# EasyEDA Pro project STM32科协学习板.eprj, schematic Schematic1
Board Name: Board1; Create Date: 2025-05-22; Page Name: P1; Project Name: STM32科协学习板; Schematic Name: Schematic1; Update Date: 2025-05-22; Company: 嘉立创EDA; Page Size: A4; Version: V1.0
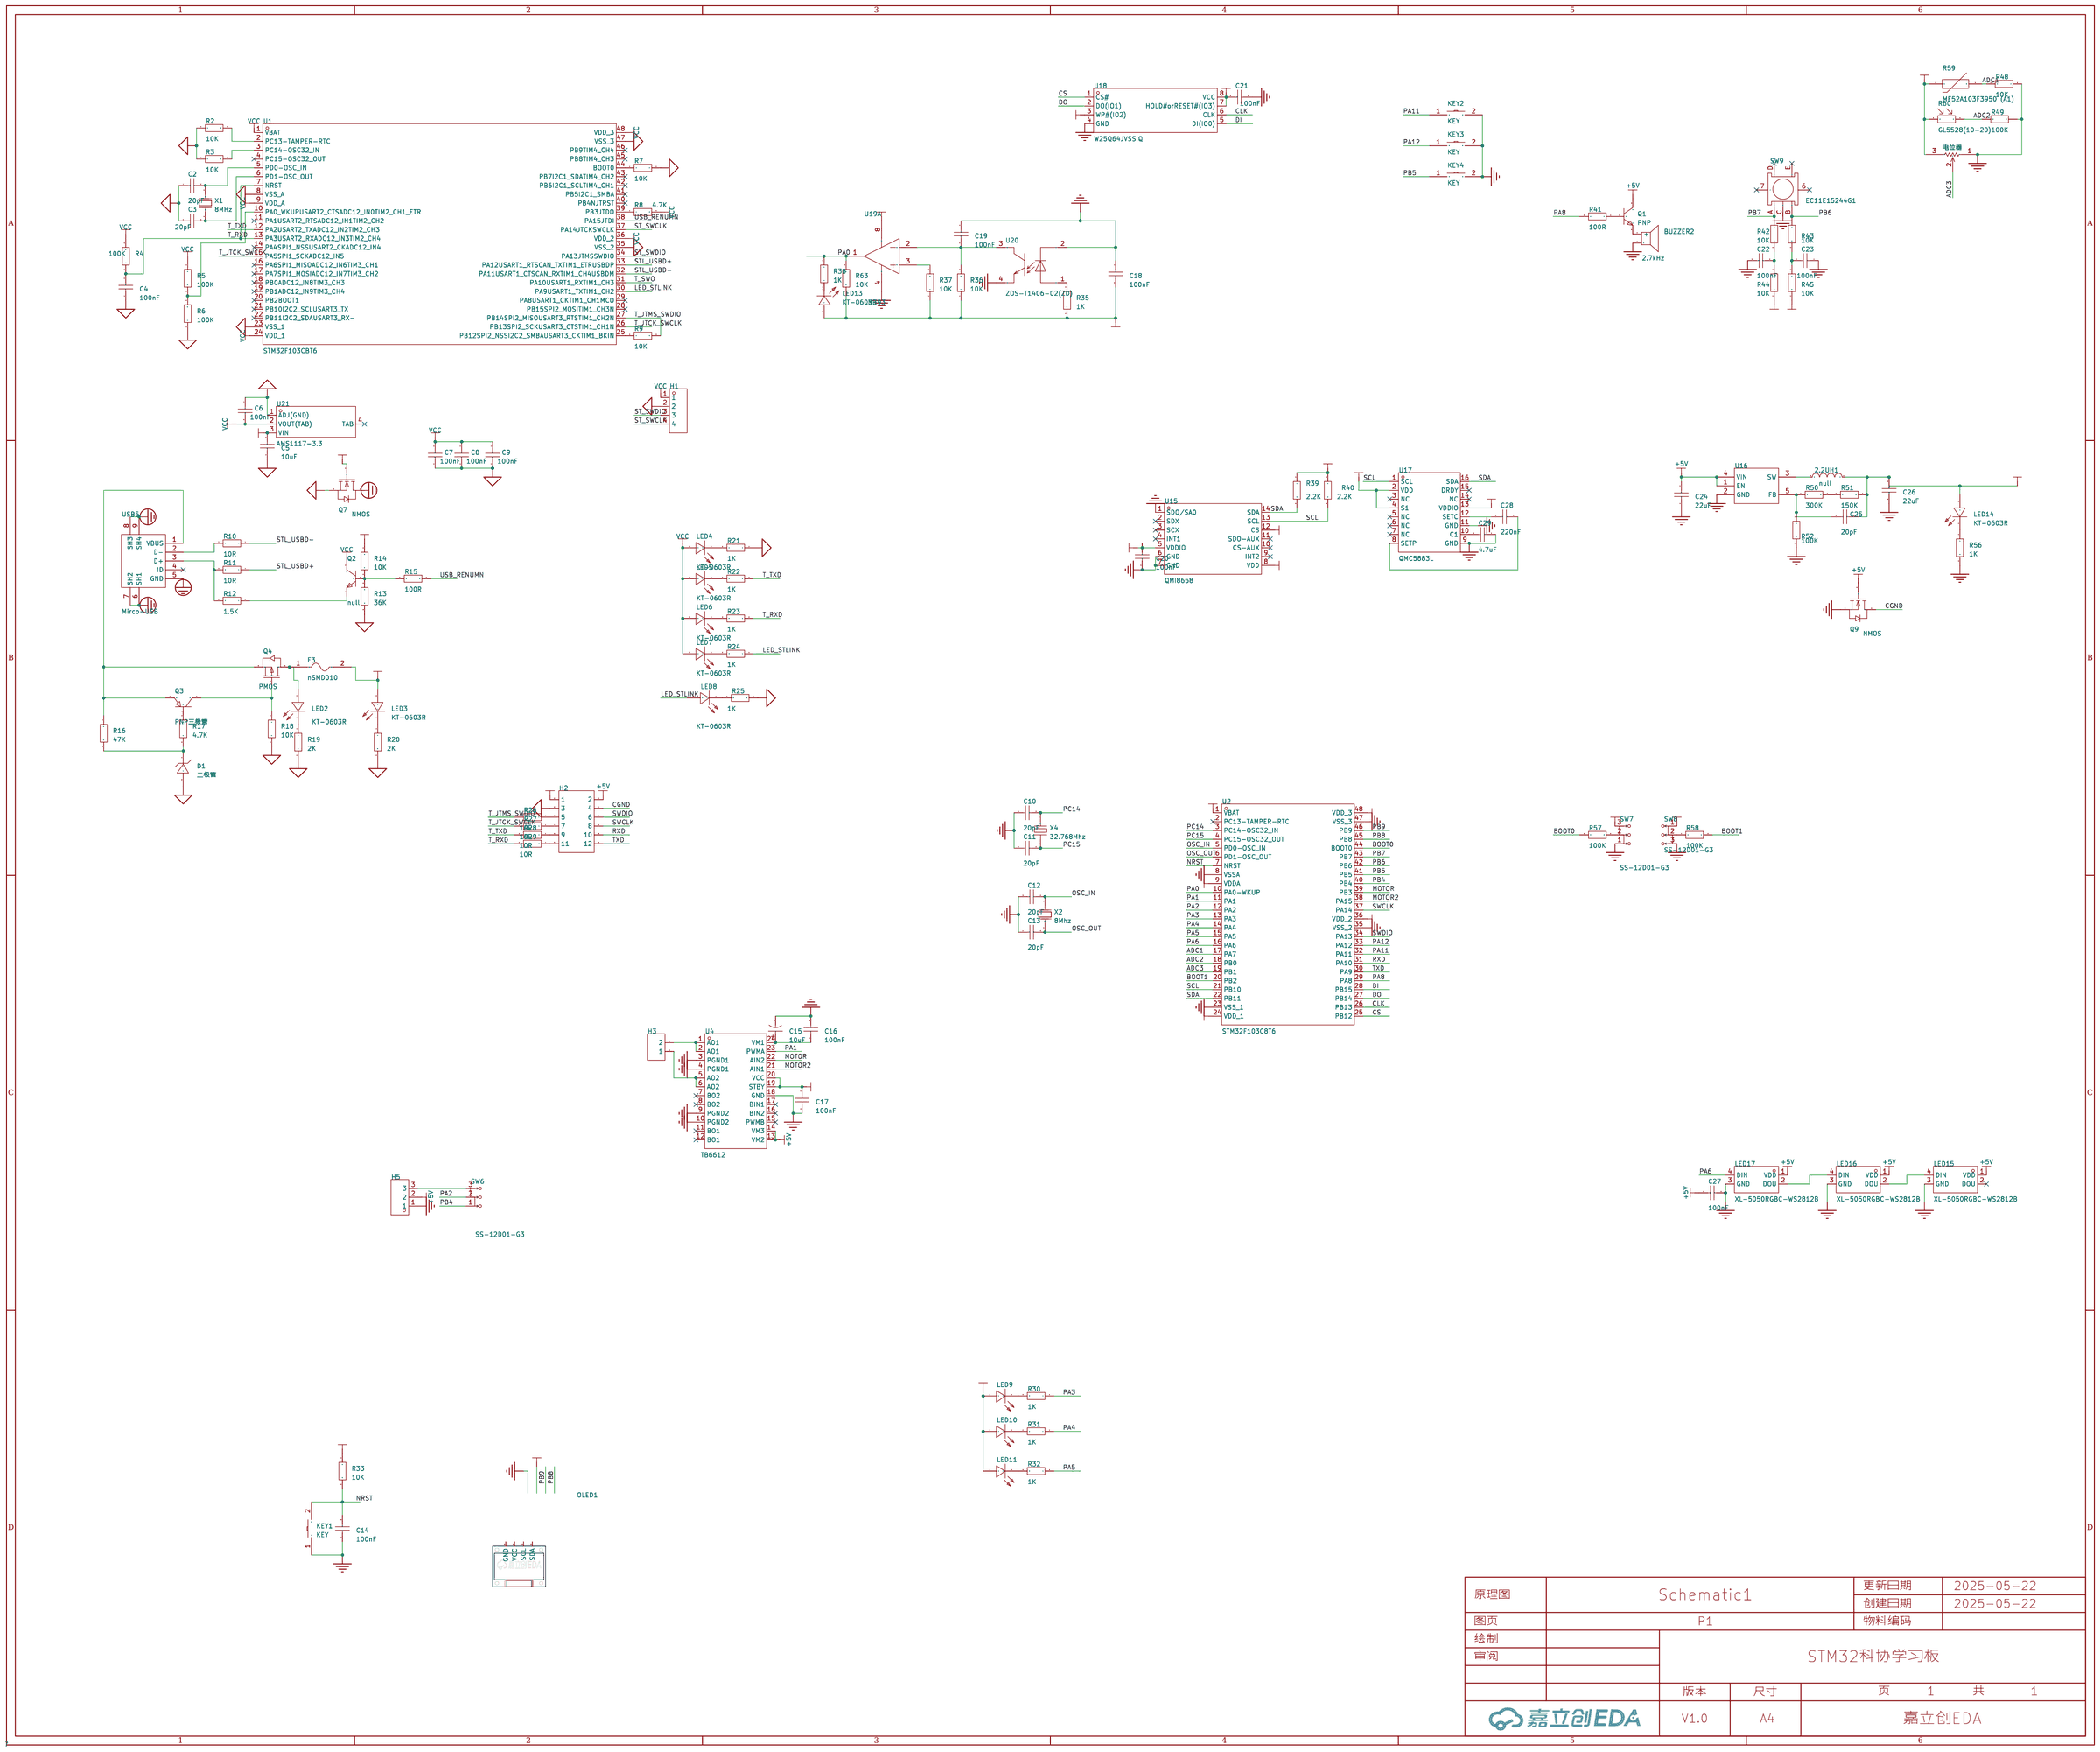
[diagram p0: schematic sheet]

## Parts
2.2UH1  2.2UH  [IND-SMD_L4.0-W4.0_FNR40XXS]
BUZZER2  2.7kHz  [BUZ-TH_BD12.0-P7.60-D0.6-FD]
C2  20pF  [C0603]
C3  20pF  [C0603]
C4  100nF  [C0603]
C5  10uF  [C0603]
C6  100nF  [C0603]
C7  100nF  [C0603]
C8  100nF  [C0603]
C9  100nF  [C0603]
C10  20pF  [C0603]
C11  20pF  [C0603]
C12  20pF  [C0603]
C13  20pF  [C0603]
C14  100nF  [C0603]
C15  10uF  [CASE-A_3216]
C16  100nF  [C0603]
C17  100nF  [C0603]
C18  100nF  [C0603]
C19  100nF  [C0603]
C20  100nF  [C0603]
C21  100nF  [C0603]
C22  100nF  [C0603]
C23  100nF  [C0603]
C24  22uF  [C0603]
C25  20pF  [C0603]
C26  22uF  [C0603]
C27  100nF  [C0603]
C28  220nF  [C0603]
C29  4.7uF  [C0603]
D1  二极管  [SOD-123_L2.7-W1.6-LS3.7-RD]
F3  nSMD010  [F1206]
H1  -  [HDR-TH_4P-P2.54-V-F]
H2  -  [HDR-TH_12P-P2.54-V-M-R2-C6-S2.54]
H3  -  [HDR-TH_2P-P2.54-V-F]
H5  -  [HDR-TH_3P-P2.54-V-F]
KEY1  KEY  [SW-SMD_L6.0-W3.3-LS8.0]
KEY2  KEY  [SW-SMD_L6.0-W3.3-LS8.0]
KEY3  KEY  [SW-SMD_L6.0-W3.3-LS8.0]
KEY4  KEY  [SW-SMD_L6.0-W3.3-LS8.0]
LED2  KT-0603R  [LED0603-RD]
LED3  KT-0603R  [LED0603-RD]
LED4  KT-0603R  [LED0603-RD]
LED5  KT-0603R  [LED0603-RD]
LED6  KT-0603R  [LED0603-RD]
LED7  KT-0603R  [LED0603-RD]
LED8  KT-0603R  [LED0603-RD]
LED9  KT-0603R  [LED0603-RD]
LED10  KT-0603R  [LED0603-RD]
LED11  KT-0603R  [LED0603-RD]
LED13  KT-0603R  [LED0603-RD]
LED14  KT-0603R  [LED0603-RD]
LED15  XL-5050RGBC-WS2812B  [LED-SMD_4P-L5.0-W5.0-BL_XL-5050RGBC]
LED16  XL-5050RGBC-WS2812B  [LED-SMD_4P-L5.0-W5.0-BL_XL-5050RGBC]
LED17  XL-5050RGBC-WS2812B  [LED-SMD_4P-L5.0-W5.0-BL_XL-5050RGBC]
OLED1  -  [0.96OLED_4P]
Q1  PNP  [SOT-23-3_L2.9-W1.3-P1.90-LS2.4-BR]
Q2  null  [SOT-23-3_L2.9-W1.3-P1.90-LS2.4-BR]
Q3  PNP三极管  [SOT-23-3_L2.9-W1.3-P1.90-LS2.4-BR]
Q4  PMOS  [SOT-23_L2.9-W1.3-P1.90-LS2.4-BR]
Q7  NMOS  [SOT-23-3_L2.9-W1.3-P1.90-LS2.4-BR]
Q9  NMOS  [SOT-23-3_L2.9-W1.3-P1.90-LS2.4-BR]
R2  10K  [R0603]
R3  10K  [R0603]
R4  100K  [R0603]
R5  100K  [R0603]
R6  100K  [R0603]
R7  10K  [R0603]
R8  4.7K  [R0603]
R9  10K  [R0603]
R10  10R  [R0603]
R11  10R  [R0603]
R12  1.5K  [R0603]
R13  36K  [R0603]
R14  10K  [R0603]
R15  100R  [R0603]
R16  47K  [R0603]
R17  4.7K  [R0603]
R18  10K  [R0603]
R19  2K  [R0603]
R20  2K  [R0603]
R21  1K  [R0603]
R22  1K  [R0603]
R23  1K  [R0603]
R24  1K  [R0603]
R25  1K  [R0603]
R26  10R  [R0603]
R27  10R  [R0603]
R28  10R  [R0603]
R29  10R  [R0603]
R30  1K  [R0603]
R31  1K  [R0603]
R32  1K  [R0603]
R33  10K  [R0603]
R35  1K  [R0603]
R36  10K  [R0603]
R37  10K  [R0603]
R38  1K  [R0603]
R39  2.2K  [R0603]
R40  2.2K  [R0603]
R41  100R  [R0603]
R42  10K  [R0603]
R43  10K  [R0603]
R44  10K  [R0603]
R45  10K  [R0603]
R48  10K  [R0603]
R49  100K  [R0603]
R50  300K  [R0603]
R51  150K  [R0603]
R52  100K  [R0603]
R56  1K  [R0603]
R57  100K  [R0603]
R58  100K  [R0603]
R59  MF52A103F3950 (A1)  [RES-TH_L2.5-W2.5-P1.70-D0.3]
R60  GL5528(10-20)  [RES-TH_L5.1-W4.3-P3.40-D0.5]
R63  10K  [R0603]
SW6  SS-12D01-G3  [SW-TH_SS-12D01-GX]
SW7  SS-12D01-G3  [SW-TH_SS-12D01-GX]
SW8  SS-12D01-G3  [SW-TH_SS-12D01-GX]
SW9  EC11E15244G1  [SW-TH_EC11E15244G1]
U1  STM32F103CBT6  [LQFP-48_L7.0-W7.0-P0.50-LS9.0-BL]
U2  STM32F103C8T6  [LQFP-48_L7.0-W7.0-P0.50-LS9.0-BL]
U4  TB6612  [SSOP-24_L8.4-W5.8-P0.65-LS7.8-BL]
U15  QMI8658  [LGA-14_L3.0-W2.5-P0.50-TL]
U16  -  [SOT-23-5_L3.0-W1.7-P0.95-LS2.8-BR]
U17  QMC5883L  [LGA-16_L3.0-W3.0-P0.50-BL_SQ]
U18  W25Q64JVSSIQ  [SOIC-8_L5.3-W5.3-P1.27-LS8.0-BL]
U19  LM393  [SOP-8_L4.9-W3.9-P1.27-LS6.0-BL]  (section 1)
U20  ZOS-T1406-02(ZD)  [OPTO-TH_ZOS-T1406-02]
U21  AMS1117-3.3  [SOT-223-4_L6.5-W3.5-P2.30-LS7.0-BR]
USB5  Mirco-USB  [MICRO-USB-SMD_MICROXNJ]
X1  8MHz  [OSC-TH_L10.0-W4.5-P5.00]
X2  8MHz  [OSC-TH_L10.0-W4.5-P5.00]
X4  32.768kHz  [OSC-SMD_L3.2-W1.5]
电位器  -  [单联拨盘电位器]

## Library data of the parts
2.2UH1 = FNR4030S4R7MT: 电感值:4.7uH;精度:±20%;额定电流:2.3A;饱和电流(Isat):3.2A;; LCSC Part Name: 4.7uH ±20% 3.2A; Supplier Part: C167874; Manufacturer: cjiang(长江微电); Supplier Footprint: SMD,4x4mm; JLCPCB Part Class: 扩展库; Datasheet: https://atta.szlcsc.com/upload/public/pdf/source/20190327/C167925_9EFF0AABC4CA629C2CC95961DBF7D39D.pdf; Supplier: LCSC; Tolerance: ±20%; Rated Current: 2.3A; Saturation Current (Isat): 3.2A; DC Resistance (DCR): 78mΩ
BUZZER2 = SUN-12095-5VPA7.6: 驱动方式:有源(内含驱动线路);构造类型:电磁式;频率:2.7kHz;声压(SPL):85dB@5V,10cm;; LCSC Part Name: 电磁有源蜂鸣器; Supplier Part: C360615; Manufacturer: S&S(海旭); Supplier Footprint: 插件,D=12mm; JLCPCB Part Class: 扩展库; Datasheet: https://atta.szlcsc.com/upload/public/pdf/source/20210819/7581CEB8074681E6630BEBBFB8B64446.pdf; Supplier: LCSC; Oscillator Circuit: 有源(内含驱动线路); Technology Type: 电磁式; Operating Voltage: 3V~7V; Sound Pressure Level (SPL): 85dB@5V,10cm; Diameter (φD): 12mm; Height: 9.8mm
C2-C14 C16-C29 = CL10C220JB8NNNC: 容值:22pF;精度:±5%;额定电压:50V;材质(温度系数):C0G;; LCSC Part Name: 22pF ±5% 50V; Supplier Part: C1653; Manufacturer: SAMSUNG(三星); Supplier Footprint: 0603; JLCPCB Part Class: 基础库; Datasheet: https://atta.szlcsc.com/upload/public/pdf/source/20160218/1457707763339.pdf; Supplier: LCSC; Tolerance: ±5%; Voltage Rated: 50V; Temperature Coefficient: C0G
C15 = CA45-A016K106T: 容值:10uF;精度:±10%;额定电压:16V;等效串联电阻:3Ω@100kHz;; LCSC Part Name: 10uF ±10% 16V; Supplier Part: C119051; Manufacturer: 湘怡中元/湘江; Supplier Footprint: CASE-A-3216; JLCPCB Part Class: 扩展库; Datasheet: https://atta.szlcsc.com/upload/public/pdf/source/20191009/C435293_78A410F3D73489DBEAC46056C4262F7A.pdf; Supplier: LCSC; Tolerance: ±10%; Rated Voltage: 16V; Equivalent Series Resistance(ESR): 3Ω@100kHz; Operating Temperature: -55℃~+125℃
D1 = BZT52C12_C173429: 二极管配置:独立式;稳压值(标称值):12V;稳压值(范围):11.4V~12.7V;功率:500mW;精度:-;; LCSC Part Name: BZT52C12; Supplier Part: C173429; Manufacturer: MDD; Manufacturer Part: BZT52C12; Supplier Footprint: SOD-123; JLCPCB Part Class: 扩展库; Datasheet: https://atta.szlcsc.com/upload/public/pdf/source/20230823/A46C7C97908205398E4407DE202CED03.pdf; Supplier: LCSC; Diode Configuration: 独立式; Zener Voltage (Nom): 12V; Reverse Leakage Current (Ir): 100nA@8V; Zener Voltage (Range): 11.4V~12.7V; Power Dissipation: 500mW; Zener Impedance (Zzt): 25Ω
F3 = nSMD010: 最大电压:60V;最大电流:40A;保持电流:100mA;跳闸电流:250mA;; LCSC Part Name: 0.10A 60V 自恢复保险丝; Supplier Part: C70065; Manufacturer: 台湾陆海; Supplier Footprint: 1206; JLCPCB Part Class: 扩展库; Datasheet: https://atta.szlcsc.com/upload/public/pdf/source/20230404/ADB19886462D98F83AD677B1F8114E76.pdf; Supplier: LCSC; Operating Voltage (Max): 60V; Current Rating (Max): 40A; Hold Current: 100mA; Trip Current: 250mA; Power Dissipation: -；-；-；-; Operating Temperature: -40℃~+85℃
H1 = HDR-F_2.54_1x4P: Supplier Part: C2718488; Supplier Footprint: 插件
H2 = HDR-F_2.54_2x6: Supplier Part: C92270; Supplier Footprint: 插件
H3 = HDR-F_2.54_1x2P: Supplier Part: C49661; Supplier Footprint: 插件
H5 = HDR-F_2.54_1x3P: Supplier Part: C541850; Supplier Footprint: 插件
KEY1-KEY4 = TS-1101-C-W: 电路结构:单刀单掷;按钮形状:矩形按钮;作用力:260gf;安装方式:立贴;开关长度:6mm;开关宽度:3.6mm;开关高度:2.5mm;带支架:不带;触点电流:50mA;额定电压(AC):-;额定电压(DC):12V;额定功率:-;绝缘电阻:-;带灯:无;机械寿命:5万次;; LCSC Part Name: 6*3.6*2.5mm 立贴 轻触开关; Supplier Part: C318938; Manufacturer: XKB Connectivity(中国星坤); Supplier Footprint: SMD; JLCPCB Part Class: 扩展库; Datasheet: https://atta.szlcsc.com/upload/public/pdf/source/20200227/C318938_C2E53B1EEDE37D980A33616AC086DE53.pdf; Supplier: LCSC; Circuit: 单刀单掷; Actuator Style: 矩形按钮; Operating Force: 260gf; Mounting Style: 立贴; Switch Length: 6mm; Switch Width: 3.6mm; Switch Height: 2.5mm; Strike Gundam: 不带; Contact Current: 50mA; Voltage Rating (DC): 12V; Actuator/Cap Color: 白色带淡绿; With Lamp: 无; Mechanical Life: 5万次; Operating Temperature: -30℃~+85℃
LED2-LED11 LED13 LED14 = KT-0603R: 发光颜色:红色;功率:-;正向电流:-;主波长:-;二极管配置:-;透镜颜色:-;色温:-;发光角度:-;载带方式:-;工作温度:-40℃~+85℃;; LCSC Part Name: 0603 红灯 高亮; Supplier Part: C2286; Manufacturer: KENTO; Supplier Footprint: 0603; JLCPCB Part Class: 基础库; Datasheet: https://atta.szlcsc.com/upload/public/pdf/source/20160616/1466072038404.pdf; Supplier: LCSC; Emitted Color: 红色; Operating Temperature: -40℃~+85℃
LED15-LED17 = XL-5050RGBC-WS2812B: 5050七彩幻彩透明贴片LED灯珠 5050 幻彩透明四脚 ws2812B 内置驱动IC; Supplier Part: C2843785; Manufacturer: XINGLIGHT(成兴光); Supplier Footprint: SMD5050; JLCPCB Part Class: 扩展库; Datasheet: https://atta.szlcsc.com/upload/public/pdf/source/20240412/E1004CAA80592E31D08BFE019083806F.pdf; Supplier: LCSC
OLED1 = 0.96OLED模块_4P: Supplier Footprint: 插件
Q1 Q2 = M8050_C266599: 晶体管类型:NPN;集电极电流(Ic):800mA;集射极击穿电压(Vceo):25V;功率(Pd):200mW;; LCSC Part Name: 耐压:25V 电流:800mA NPN; Supplier Part: C266599; Manufacturer: BORN(伯恩半导体); Manufacturer Part: M8050; Supplier Footprint: SOT-23; JLCPCB Part Class: 扩展库; Datasheet: https://atta.szlcsc.com/upload/public/pdf/source/20190325/C266599_C3D99E625B293D75672D2862955AF640.pdf; Supplier: LCSC; Transistor Type: NPN; Collector Current (Ic): 800mA; Collector-Emitter Breakdown Voltage (Vceo): 25V; Power Dissipation (Pd): 200mW
Q3 = PMBT3906,215: 晶体管类型:PNP;集电极电流(Ic):200mA;集射极击穿电压(Vceo):40V;功率(Pd):250mW;直流电流增益(hFE@Ic,Vce):100@10mA,1V;; LCSC Part Name: PNP 电流:200mA 耐压:40V; Supplier Part: C8670; Manufacturer: Nexperia(安世); Supplier Footprint: SOT-23; JLCPCB Part Class: 扩展库; Datasheet: https://atta.szlcsc.com/upload/public/pdf/source/20130412/1457706600965.pdf; Supplier: LCSC; Transistor Type: PNP; Collector Current (Ic): 200mA; Collector-Emitter Breakdown Voltage (Vceo): 40V; Power Dissipation (Pd): 250mW; DC Current Gain (hFE@Ic,Vce): 100@10mA,1V; Transition Frequency (fT): 250MHz; Collector Cut-Off Current (Icbo): 50nA; Collector-Emitter Saturation Voltage (VCE(sat)@Ic,Ib): 400mV@50mA,5mA
Q4 = AO3401A_C347476: 类型:1个P沟道;漏源电压(Vdss):30V;连续漏极电流(Id):4.2A;功率(Pd):1.4W;导通电阻(RDS(on)@Vgs,Id):50mΩ@4.2A,10V;阈值电压(Vgs(th)@Id):1.3V@250uA;; LCSC Part Name: 1个P沟道 耐压:30V 电流:4.2A; Supplier Part: C347476; Manufacturer: UMW(友台半导体); Manufacturer Part: AO3401A; Supplier Footprint: SOT-23; JLCPCB Part Class: 扩展库; Datasheet: https://atta.szlcsc.com/upload/public/pdf/source/20231109/42F312EBB081D72F04A7E8221BFFAF9D.pdf; Supplier: LCSC; Type: 1个P沟道; Drain Source Voltage (Vdss): 30V; Continuous Drain Current (Id): 4.2A; Power Dissipation (Pd): 1.4W; Drain Source On Resistance (RDS(on)@Vgs,Id): 50mΩ@4.2A,10V; Gate Threshold Voltage (Vgs(th)@Id): 1.3V@250uA; Total Gate Charge (Qg@Vgs): 9.4nC@4.5V; Input Capacitance (Ciss@Vds): 954pF@15V
Q7 Q9 = 2N7002_C8545: 类型:1个N沟道;漏源电压(Vdss):60V;连续漏极电流(Id):115mA;导通电阻(RDS(on)@Vgs,Id):5Ω@10V;功率(Pd):225mW;阈值电压(Vgs(th)@Id):2.5V@250uA;; LCSC Part Name: 1个N沟道 耐压:60V 电流:115mA; Supplier Part: C8545; Manufacturer: CJ(江苏长电/长晶); Supplier Footprint: SOT-23; JLCPCB Part Class: 基础库; Datasheet: https://atta.szlcsc.com/upload/public/pdf/source/20171228/C164913_15144413269051213916.pdf; Supplier: LCSC; Type: 1个N沟道; Drain Source Voltage (Vdss): 60V; Continuous Drain Current (Id): 115mA; Drain Source On Resistance (RDS(on)@Vgs,Id): 5Ω@10V; Power Dissipation (Pd): 225mW; Gate Threshold Voltage (Vgs(th)@Id): 2.5V@250uA; Input Capacitance (Ciss@Vds): 50pF; Reverse Transfer Capacitance (Crss@Vds): 5pF; Operating Temperature: -55℃~+150℃
R2-R33 R35-R45 R48-R52 R56-R58 R63 = 0603WAF200JT5E: 电阻类型:厚膜电阻;阻值:20Ω;精度:±1%;功率:100mW;最大工作电压:75V;温度系数:±100ppm/℃;; LCSC Part Name: 20Ω ±1% 100mW 厚膜电阻; Supplier Part: C22950; Manufacturer: UNI-ROYAL(厚声); Supplier Footprint: 0603; JLCPCB Part Class: 基础库; Datasheet: https://atta.szlcsc.com/upload/public/pdf/source/20200306/C422600_1E6D84923E4A46A82E41ADD87F860B5C.pdf; Supplier: LCSC; Type: 厚膜电阻; Tolerance: ±1%; Power(Watts): 100mW; Overload Voltage (Max): 75V; Temperature Coefficient: ±100ppm/℃; Operating Temperature Range: -55℃~+155℃
R59 = MF52A103F3950 (A1): 阻值(25℃):10kΩ;B值(25℃/50℃):3950K;电阻精度:±1%;功率:50mW;B值精度:±1%;最大稳态电流(25℃):-;; LCSC Part Name: 10kΩ 电阻精度:±1% 3950K; Supplier Part: C13879; Manufacturer: 时恒; Supplier Footprint: 插件,P=1.7mm; JLCPCB Part Class: 扩展库; Datasheet: https://atta.szlcsc.com/upload/public/pdf/source/20181018/C324070_6015F64EA824A635FDB9BBFA1E1FD5FE.pdf; Supplier: LCSC; Resistance @ 25℃: 10kΩ; B Constant (25℃/50℃): 3950K; Resistance Tolerance: ±1%; Power: 50mW; B Constant Tolerance: ±1%; Operating Temperature: -55℃~+125℃
R60 = GL5528(10-20)_C10081: 暗电阻:1MΩ;亮电阻 @ 10Lux:10kΩ~20kΩ;光谱峰值(波长):540nm;; LCSC Part Name: 亮电阻:10kΩ~20kΩ 暗电阻:1MΩ; Supplier Part: C10081; Manufacturer: JCHL(晶创和立); Supplier Footprint: 插件,P=3.4mm; JLCPCB Part Class: 扩展库; Datasheet: https://atta.szlcsc.com/upload/public/pdf/source/20200417/C515010_C10502EF7F431E893A7F20DB83F527F0.pdf; Supplier: LCSC; Dark Resistance: 1MΩ; Illuminated Resistance @ 10Lux: 10kΩ~20kΩ; Applied Voltage: 150V; Spectral Peak: 540nm
SW6-SW8 = SS-12D01-G3: 柄长3MM,1P2T,額定電源:0.3A ,50VDC,迴路:1P2T,操作力:250gf接觸阻抗:200mΩ,使用次數:10,000次,焊接方式:DIP TYPE,包裝方式:1,000PCS/Bag; LCSC Part Name: 8.8*3.9*4.0mm/柄长3MM,1P2T; Supplier Part: C698216; Manufacturer: USAKRO(美韩); Supplier Footprint: 插件; JLCPCB Part Class: 扩展库; Datasheet: https://atta.szlcsc.com/upload/public/pdf/source/20200708/C698216_8FC6F08F494B3050452EEB3EFAC4260D.pdf; Supplier: LCSC
SW9 = EC11E15244G1: LCSC Part Name: 编码器; Supplier Part: C370970; Manufacturer: ALPSALPINE(阿尔卑斯阿尔派); Supplier Footprint: 插件; JLCPCB Part Class: 扩展库; Datasheet: https://atta.szlcsc.com/upload/public/pdf/source/20190222/C370970_45D3DFC793E5CF6FACAF06DB9E7FAE9E.pdf; Supplier: LCSC
U1 = STM32F103CBT6: CPU内核:ARM-M3;程序存储容量:128KB;RAM总容量:20KB;GPIO端口数量:37;工作电压范围:2V~3.6V;CPU最大主频:72MHz;程序存储器类型:FLASH;; LCSC Part Name: 主流增强型ARM Cortex-M3 MCU，具有128 KB Flash、72 MHz CPU、电机控制、USB和CAN; Supplier Part: C8304; Manufacturer: ST(意法半导体); Supplier Footprint: LQFP-48(7x7); JLCPCB Part Class: 扩展库; Datasheet: https://atta.szlcsc.com/upload/public/pdf/source/20150811/1457707344439.pdf; Supplier: LCSC; CPU Core: ARM-M3; Program Storage Size: 128KB; RAM Size: 20KB; GPIO Ports Number: 37; Operating Voltage Range: 2V~3.6V; CPU Maximum Speed: 72MHz; Program Memory Type: FLASH; Operating Temperature Range: -40℃~+85℃; ADC (Bit): 12bit; Universal Serial Bus: 有; Peripheral/Function: DMA；温度传感器；PWM; Watchdog: 有; Infrared Data Association: 有; Low-Voltage Detect: 有; Direct Memory Access: 有; Internal Oscillator: 有
U2 = STM32F103C8T6: CPU内核:ARM-M3;程序存储容量:64KB;RAM总容量:20KB;GPIO端口数量:37;工作电压范围:2V~3.6V;CPU最大主频:72MHz;程序存储器类型:FLASH;; LCSC Part Name: 主流增强型ARM Cortex-M3 MCU，具有64 KB Flash、72 MHz CPU、电机控制、USB和CAN; Supplier Part: C8734; Manufacturer: ST(意法半导体); Supplier Footprint: LQFP-48(7x7); JLCPCB Part Class: 扩展库; Datasheet: https://atta.szlcsc.com/upload/public/pdf/source/20220812/8363ACEC51AD55ECEB84799464F7CB85.pdf; Supplier: LCSC; CPU Core: ARM-M3; Program Storage Size: 64KB; RAM Size: 20KB; GPIO Ports Number: 37; Operating Voltage Range: 2V~3.6V; CPU Maximum Speed: 72MHz; Program Memory Type: FLASH; Operating Temperature Range: -40℃~+85℃; ADC (Bit): 12bit; Universal Serial Bus: 有; Peripheral/Function: 看门狗；DMA；看门狗；温度传感器; Watchdog: 有; Infrared Data Association: 有; Low-Voltage Detect: 有; Direct Memory Access: 有; Internal Oscillator: 有
U4 = TB6612FNG(O,C,8,EL: 双直流电机驱动器集成电路; Supplier Part: C88224; Manufacturer: TOSHIBA(东芝); Supplier Footprint: SSOP-24-208mil; JLCPCB Part Class: 扩展库; Datasheet: https://atta.szlcsc.com/upload/public/pdf/source/20171128/C141517_15118625624231147036.pdf; Supplier: LCSC
U15 = QMI8658A_C3021082: LCSC Part Name: 六轴陀螺仪; Supplier Part: C3021082; Manufacturer: QST(上海矽睿); Manufacturer Part: QMI8658A; Supplier Footprint: LGA-14; JLCPCB Part Class: 扩展库; Datasheet: https://atta.szlcsc.com/upload/public/pdf/source/20230804/748E61E1BAEF8C31413DC641004C80DF.pdf; Supplier: LCSC
U16 = TLV62568DBVR
U17 = QMC5883L: LCSC Part Name: 三轴磁传感器; Supplier Part: C976032; Manufacturer: QST(上海矽睿); Supplier Footprint: LGA-16(3x3); JLCPCB Part Class: 扩展库; Datasheet: https://atta.szlcsc.com/upload/public/pdf/source/20201217/C976032_5B9A2F3901E175046CBA037B1F18A1F2.pdf; Supplier: LCSC
U18 = W25Q64JVSSIQ: Supplier Part: C179171; Manufacturer: WINBOND(华邦); Supplier Footprint: SOIC-8-208mil; JLCPCB Part Class: 扩展库; Datasheet: https://atta.szlcsc.com/upload/public/pdf/source/20191218/C179171_92C5C91D0324539EDD8F1160D2E79C0F.pdf; Supplier: LCSC
U19 = LM393_C400839: 输入失调电压(Vos):3mV;输入偏置电流(Ib):-;轨到轨:-;; Supplier Part: C400839; Manufacturer: IDCHIP(英锐芯); Supplier Footprint: SOP-8; JLCPCB Part Class: 扩展库; Datasheet: https://atta.szlcsc.com/upload/public/pdf/source/20240308/5ED8EE163AE67417F731F81F7E9D3786.pdf; Supplier: LCSC; Input Offset Voltage (Vos): 3mV; Supply Voltage: 24V; Supply Current: 2.5mA
U20 = ZOS-T1406-02(ZD): 对射式光电开关; Supplier Part: C457835; Manufacturer: Chau Light(洲光源); Supplier Footprint: DIP-4; JLCPCB Part Class: 扩展库; Datasheet: https://atta.szlcsc.com/upload/public/pdf/source/20191118/C457835_B68538B5B8173DC28DDDBA7240D9FDD7.pdf; Supplier: LCSC
U21 = AMS1117-3.3_C347222: 输出类型:固定;最大输入电压:12V;输出电压:3.3V;输出电流:1A;电源纹波抑制比(PSRR):60dB@(120Hz);输出极性:正极;; LCSC Part Name: 输出:3.3V 电流:1A 耐压:12V; Supplier Part: C347222; Manufacturer: UMW(友台半导体); Supplier Footprint: SOT-223; JLCPCB Part Class: 扩展库; Datasheet: https://atta.szlcsc.com/upload/public/pdf/source/20231109/155D79A26D9DB04352555A58D5969DC8.pdf; Supplier: LCSC; Output Type: 固定; Maximum Input Voltage: 12V; Output Voltage: 3.3V; Output Current: 1A; Power Supply Rejection Ratio (PSRR): 60dB@(120Hz); Dropout Voltage: 1.3V@(1A); Feature: 过流保护(OCP); Output Polarity: 正极; Number of Outputs: 1
USB5 = MicroXNJ: 连接器类型:Micro-B;标准:USB 2.0;公母:母;安装方式:卧贴;触点数量:5P;端口数量:1;额定电流 - 电源:1A;工作温度范围:-20℃~+85℃;; LCSC Part Name: Micro-B 母 卧贴; Supplier Part: C404969; Manufacturer: SHOU HAN(首韩); Supplier Footprint: SMD; JLCPCB Part Class: 扩展库; Datasheet: https://atta.szlcsc.com/upload/public/pdf/source/20220415/2494EDFF499AF6F852F7C820374B6AF3.pdf; Supplier: LCSC; Connector Type: Micro-B; Standard: USB 2.0; Gender: 母; Mounting Style: 卧贴; Number of Contacts: 5P; Number of Ports: 1; Current Rating - Power (Max): 1A; Operating Temperature Range: -20℃~+85℃
X1 X2 = X49SD8MSD2SC: 晶振类型:直插晶振;频率:8MHz;常温频差:±20ppm;外接负载电容:20pF;频率稳定度(全温):±30ppm;; LCSC Part Name: 8MHz ±20ppm 20pF; Supplier Part: C21263; Manufacturer: YXC(扬兴晶振); Supplier Footprint: HC-49S; JLCPCB Part Class: 扩展库; Datasheet: https://atta.szlcsc.com/upload/public/pdf/source/20240329/977D7F2434F98B2BE33270BB9FF3D86D.pdf; Supplier: LCSC; Crystal Type: 直插晶振; Normal temperature Frequency Tolerance: ±20ppm; External load capacitor: 20pF; Frequency Stability(Full temperature range): ±30ppm; Operating Temperature: -20℃~+70℃
X4 = X321532768KGD2SI: 晶振类型:贴片晶振;频率:32.768kHz;常温频差:±20ppm;外接负载电容:12.5pF;频率稳定度(全温):-;; LCSC Part Name: 32.768kHz ±20ppm 12.5pF; Supplier Part: C620155; Manufacturer: YXC(扬兴晶振); Supplier Footprint: SMD3215-2P; JLCPCB Part Class: 扩展库; Datasheet: https://atta.szlcsc.com/upload/public/pdf/source/20240329/3A7650FD985DD0DE85694D3785AB4916.pdf; Supplier: LCSC; Crystal Type: 贴片晶振; Normal temperature Frequency Tolerance: ±20ppm; External load capacitor: 12.5pF; Operating Temperature: -40℃~+85℃
电位器 = 单联拨盘齿轮电位器: 拨盘直径16mm 厚度2mm; Supplier: https://detail.tmall.com/item.htm?id=550315376847&spm=a1z09.2.0.0.48ef2e8dhYFNNw&_u=3r9i0on05ab; Resistance: 1K

## Nets
3V3: 2.2UH1.2 C17.2 C18.2 C20.2 C21.2 C25.2 C26.2 LED9.2(A) LED10.2(A) LED11.2(A) LED13.2(A) LED14.2(A) R33.1 R35.1 R36.1 R37.1 R39.1 R40.1 R44.2 R45.2 R51.2 R59.1 R60.1 R63.1 SW7.3 SW8.1 U2.1(VBAT) U2.9(VDDA) U2.24(VDD_1) U2.36(VDD_2) U2.48(VDD_3) U4.19(STBY) U4.20(VCC) U15.5(VDDIO) U15.8(VDD) U15.12(CS) U17.2(VDD) U17.4(S1) U17.13(VDDIO) U18.3(WP#(IO2)) U18.7(HOLD#orRESET#(IO3)) U18.8(VCC) U19.8(VCC) 电位器.3
5V: C5.2 F3.2 H2.1 LED3.2(A) Q7.1(G) R14.1 U21.3(VIN)
+5V: C24.2 C27.1 H2.2 H5.2 LED15.1(VDD) LED16.1(VDD) LED17.1(VDD) Q1.3(C) Q9.1(G) U4.13(VM2) U4.14(VM3) U16.1(EN) U16.4(VIN)
AGND: C2.1 C3.1 C4.1 C5.1 C6.1 C7.2 C8.2 C9.2 D1.2(A) H1.2 H2.3 Q7.2(S) R2.1 R3.1 R6.1 R7.2 R13.2 R18.2 R19.2 R20.2 R21.1 R25.1 U1.8(VSS_A) U1.23(VSS_1) U1.35(VSS_2) U1.47(VSS_3) U21.1(ADJ(GND))
GND: BUZZER2.2 C10.1 C11.1 C12.1 C13.1 C14.1 C15.2 C16.2 C17.1 C18.1 C19.1 C20.1 C21.1 C22.2 C23.1 C24.1 C26.1 C27.2 C29.1 H5.1 KEY1.1 KEY2.2 KEY3.2 KEY4.2 LED15.3(GND) LED16.3(GND) LED17.3(GND) Q9.2(S) R48.2 R49.2 R52.1 R56.2 SW7.1 SW8.3 SW9.C U2.8(VSSA) U2.23(VSS_1) U2.35(VSS_2) U2.47(VSS_3) U4.3(PGND1) U4.4(PGND1) U4.9(PGND2) U4.10(PGND2) U4.18(GND) U15.1(SDO/SA0) U15.6(GND) U15.7(GND) U16.2(GND) U17.9(GND) U17.11(GND) U18.4(GND) U19.4(GND) U20.2(C) U20.4(EM) 电位器.1
PGND: Q7.3(D) USB5.5(GND) USB5.6(SH1) USB5.7(SH2) USB5.8(SH3) USB5.9(SH4)
VCC: C6.2 C7.1 C8.1 C9.1 H1.1 LED4.2(A) LED5.2(A) LED6.2(A) LED7.2(A) Q2.3(C) R4.2 R5.2 R8.2 U1.1(VBAT) U1.9(VDD_A) U1.24(VDD_1) U1.36(VDD_2) U1.48(VDD_3) U21.2(VOUT(TAB))
ADC1: R48.1 R59.2 U2.17(PA7)
ADC2: R49.1 R60.2 U2.18(PB0)
ADC3: U2.19(PB1) 电位器.2
BOOT0: R57.1 U2.44(BOOT0)
BOOT1: R58.2 U2.20(PB2)
CGND: H2.4 Q9.3(D)
CLK: U2.26(PB13) U18.6(CLK)
CS: U2.25(PB12) U18.1(CS#)
DI: U2.28(PB15) U18.5(DI(IO0))
DO: U2.27(PB14) U18.2(DO(IO1))
LED_STLINK: LED8.2(A) R24.1 U1.30(PA9USART1_TXTIM1_CH2)
MOTOR: U2.39(PB3) U4.22(AIN2)
MOTOR2: U2.38(PA15) U4.21(AIN1)
NRST: C14.2 KEY1.2 R33.2 U2.7(NRST)
OSC_IN: C12.2 U2.5(PD0-OSC_IN) X2.1(OSC1)
OSC_OUT: C13.2 U2.6(PD1-OSC_OUT) X2.2(OSC2)
PA0: R38.2 R63.2 U2.10(PA0-WKUP) U19.1(OUTA)
PA1: U2.11(PA1) U4.23(PWMA)
PA2: SW6.2 U2.12(PA2)
PA3: R30.1 U2.13(PA3)
PA4: R31.1 U2.14(PA4)
PA5: R32.1 U2.15(PA5)
PA6: LED17.4(DIN) U2.16(PA6)
PA8: R41.2 U2.29(PA8)
PA11: KEY2.1 U2.32(PA11)
PA12: KEY3.1 U2.33(PA12)
PB4: SW6.1 U2.40(PB4)
PB5: KEY4.1 U2.41(PB5)
PB6: R43.1 SW9.B U2.42(PB6)
PB7: R42.1 SW9.A U2.43(PB7)
PB8: U2.45(PB8)
PB9: U2.46(PB9)
PC14: C10.2 U2.3(PC14-OSC32_IN) X4.2
PC15: C11.2 U2.4(PC15-OSC32_OUT) X4.1
RXD: H2.10 U2.31(PA10)
SCL: R40.2 U2.21(PB10) U15.13(SCL) U17.1(SCL)
SDA: R39.2 U2.22(PB11) U15.14(SDA) U17.16(SDA)
ST_SWCLK: H1.4 U1.37(PA14JTCKSWCLK)
ST_SWDIO: H1.3 U1.34(PA13JTMSSWDIO)
STL_USBD+: R11.1 U1.33(PA12USART1_RTSCAN_TXTIM1_ETRUSBDP)
STL_USBD-: R10.1 U1.32(PA11USART1_CTSCAN_RXTIM1_CH4USBDM)
SWCLK: H2.8 U2.37(PA14)
SWDIO: H2.6 U2.34(PA13)
T_JTCK_SWCLK: R27.2 U1.15(PA5SPI1_SCKADC12_IN5) U1.26(PB13SPI2_SCKUSART3_CTSTIM1_CH1N)
T_JTMS_SWDIO: R9.2 R26.2 U1.27(PB14SPI2_MISOUSART3_RTSTIM1_CH2N)
T_RXD: R23.1 R29.2 U1.13(PA3USART2_RXADC12_IN3TIM2_CH4)
T_SWO: U1.31(PA10USART1_RXTIM1_CH3)
T_TXD: R22.1 R28.2 U1.12(PA2USART2_TXADC12_IN2TIM2_CH3)
TXD: H2.12 U2.30(PA9)
USB_RENUMN: R15.1 U1.38(PA15JTDI)
$1N931: R2.2 U1.2(PC13-TAMPER-RTC)
$1N970: R3.2 U1.3(PC14-OSC32_IN)
$1N1046: C2.2 U1.5(PD0-OSC_IN) X1.1(OSC1)
$1N1051: C3.2 U1.6(PD1-OSC_OUT) X1.2(OSC2)
$1N1278: C4.2 R4.1 U1.7(NRST)
$1N1456: R5.1 R6.2 U1.10(PA0_WKUPUSART2_CTSADC12_IN0TIM2_CH1_ETR)
$1N1752: R7.1 U1.44(BOOT0)
$1N1820: R8.1 U1.39(PB3JTDO)
$1N1929: R9.1 U1.25(PB12SPI2_NSSI2C2_SMBAUSART3_CKTIM1_BKIN)
$1N2269: R10.2 USB5.2(D-)
$1N2364: R11.2 R12.2 USB5.3(D+)
$1N2410: Q2.2(E) R12.1
$1N2449: Q2.1(B) R13.1 R14.2 R15.2
$1N3256: LED2.1(K) R19.1
$1N3443: LED3.1(K) R20.1
$1N3731: LED4.1(K) R21.2
$1N3770: LED5.1(K) R22.2
$1N3809: LED6.1(K) R23.2
$1N3848: LED7.1(K) R24.2
$1N3897: LED8.1(K) R25.2
$1N4274: H2.5 R26.1
$1N4313: H2.7 R27.1
$1N4352: H2.9 R28.1
$1N4391: H2.11 R29.1
$1N6201: LED9.1(K) R30.2
$1N6284: LED10.1(K) R31.2
$1N6367: LED11.1(K) R32.2
$1N7024: H3.2 U4.1(AO1) U4.2(AO1)
$1N7031: H3.1 U4.5(AO2) U4.6(AO2)
$1N7219: C15.1 C16.1 U4.24(VM1)
$1N8042: C19.2 R36.2 U19.2(INA-) U20.3(COL)
$1N8188: LED13.1(K) R38.1
$1N11873: Q1.1(B) R41.1
$1N12045: C22.1 R42.2 R44.1
$1N12084: C23.2 R43.2 R45.1
$1N13209: C25.1 R50.1 R52.2 U16.5(FB)
$1N13248: R50.2 R51.1
$1N13469: 2.2UH1.1 U16.3(SW)
$1N13973: LED14.1(K) R56.1
$1N14191: H5.3 SW6.3
$1N14332: R57.2 SW7.2
$1N14371: R58.1 SW8.2
$1N14600: LED16.4(DIN) LED17.2(DOU)
$1N14605: LED15.4(DIN) LED16.2(DOU)
$1N14999: C28.2 U17.12(SETC)
$1N15003: C28.1 U17.8(SETP)
$1N15040: C29.2 U17.10(C1)
$1N16611: BUZZER2.1(+) Q1.2(E)
$1N16712: R37.2 U19.3(INA+)
$1N16792: R35.2 U20.1(A)
$1N17153: Q3.2(E) Q4.2(S) R16.1 USB5.1(VBUS)
$1N17154: Q3.3(C) Q4.1(G) R18.1
$1N17155: Q3.1(B) R17.1
$1N17156: D1.1(K) R16.2 R17.2
$1N17582: F3.1 LED2.2(A) Q4.3(D)

Not connected (* = marked no-connect by the designer): LED15 2(DOU)*; OLED1 1(GND) 2(VCC) 3(SCL) 4(SDA); SW9 6* 7* D* E*; U1 4(PC15-OSC32_OUT)* 11(PA1USART2_RTSADC12_IN1TIM2_CH2)* 14(PA4SPI1_NSSUSART2_CKADC12_IN4)* 16(PA6SPI1_MISOADC12_IN6TIM3_CH1)* 17(PA7SPI1_MOSIADC12_IN7TIM3_CH2)* 18(PB0ADC12_IN8TIM3_CH3)* 19(PB1ADC12_IN9TIM3_CH4)* 20(PB2BOOT1)* 21(PB10I2C2_SCLUSART3_TX)* 22(PB11I2C2_SDAUSART3_RX-)* 28(PB15SPI2_MOSITIM1_CH3N)* 29(PA8USART1_CKTIM1_CH1MCO)* 40(PB4NJTRST)* 41(PB5I2C1_SMBA)* 42(PB6I2C1_SCLTIM4_CH1)* 43(PB7I2C1_SDATIM4_CH2)* 45(PB8TIM4_CH3)* 46(PB9TIM4_CH4)*; U2 2(PC13-TAMPER-RTC)*; U4 7(BO2)* 8(BO2)* 11(BO1)* 12(BO1)* 15(PWMB)* 16(BIN2)* 17(BIN1)*; U15 2(SDX)* 3(SCX)* 4(INT1)* 9(INT2)* 10(CS-AUX)* 11(SDO-AUX)*; U17 3(NC)* 5(NC)* 6(NC)* 7(NC)* 14(NC)* 15(DRDY)*; U21 4(TAB)*; USB5 4(ID)*
